# Altium schematic sheet RF.SchDoc: RF
size A4
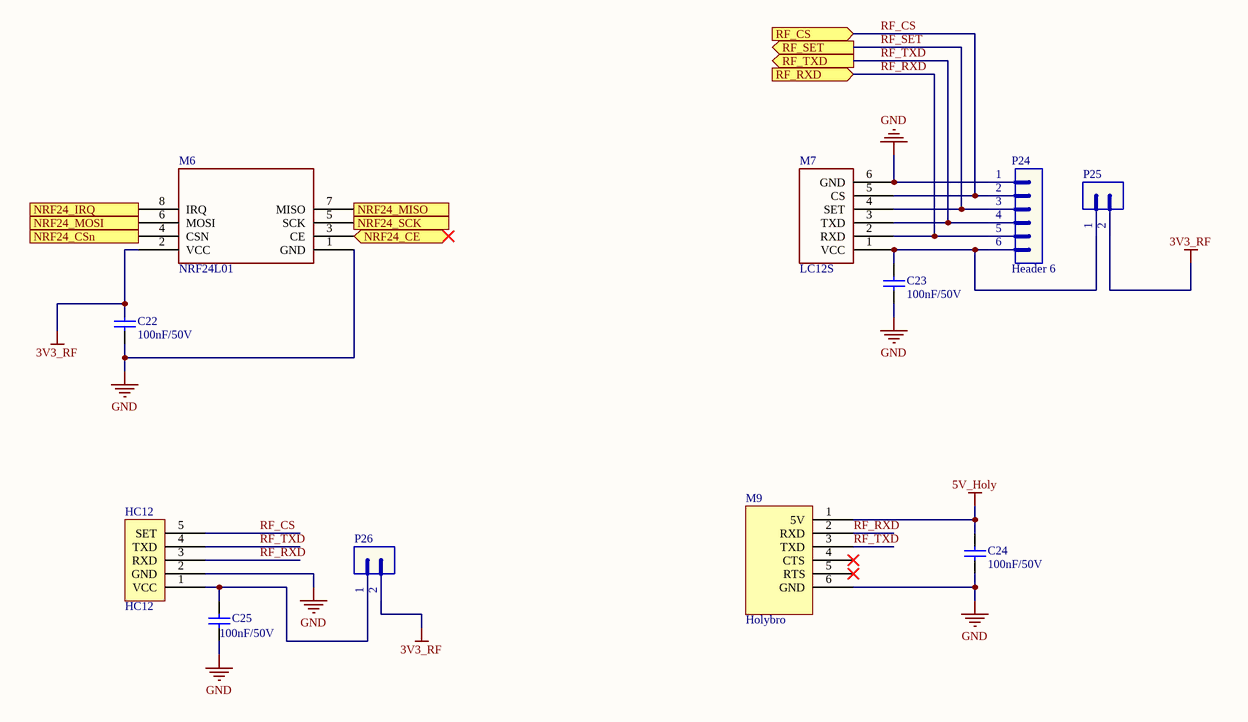
[diagram p0: RF.SchDoc]

## Parts
C22  value 100nF/50V  [CAP-SM-0805]  (hidden comment: Cap-100nF-50V-0805)
C23  value 100nF/50V  [CAP-SM-0805]  (hidden comment: Cap-100nF-50V-0805)
C24  value 100nF/50V  [CAP-SM-0805]  (hidden comment: Cap-100nF-50V-0805)
C25  value 100nF/50V  [CAP-SM-0805]  (hidden comment: Cap-100nF-50V-0805)
HC12  HC12  [HC12]
M6  NRF24L01  [NRF24L01]
M7  LC12S  [LC12S]
M9  Holybro  [Holybro]
P24  Header 6  [JP6]
P25  Header 2  [JP2]  (value not drawn)
P26  Header 2  [JP2]  (value not drawn)

## Ports
NRF24_CE (bidir), NRF24_CSn (in), NRF24_IRQ (out), NRF24_MISO (out), NRF24_MOSI (in), NRF24_SCK (in), RF_CS (in), RF_RXD (in), RF_SET (out), RF_TXD (out)

## Nets
3V3_RF: C22.2 M6.2(VCC) P25.2 P26.2
5V_Holy: C24.2 M9.1(5V)
GND: C22.1 C23.1 C24.1 C25.1 HC12.2(GND) M6.1(GND) M7.6(GND) M9.6(GND) P24.1
NRF24_CE: M6.3(CE) ; port NRF24_CE
NRF24_CSn: M6.4(CSN) ; port NRF24_CSn
NRF24_IRQ: M6.8(IRQ) ; port NRF24_IRQ
NRF24_MISO: M6.7(MISO) ; port NRF24_MISO
NRF24_MOSI: M6.6(MOSI) ; port NRF24_MOSI
NRF24_SCK: M6.5(SCK) ; port NRF24_SCK
RF_CS: HC12.5(SET) M7.5(CS) P24.2 ; port RF_CS
RF_RXD: HC12.3(RXD) M7.2(RXD) M9.2(RXD) P24.5 ; port RF_RXD
RF_SET: M7.4(SET) P24.3 ; port RF_SET
RF_TXD: HC12.4(TXD) M7.3(TXD) M9.3(TXD) P24.4 ; port RF_TXD
NetC23_2: C23.2 M7.1(VCC) P24.6 P25.1
NetC25_2: C25.2 HC12.1(VCC) P26.1

Not connected (* = marked no-connect by the designer): M9 4(CTS)* 5(RTS)*

## Notes on the sheet
- Title
- Size:
- Date:
- A4
- Number:
- Time:
- Revision:
- Sheet
- of
- File:

## Library data of the parts
C22-C25 = Cap-100nF-50V-0805: CAP CER 0.1UF 50V Y5V 0805; Manufacturer: Samsung Electro-Mechanics; Manufacturer Part Number: CL21F104ZBCNNNC; Local Supplier: thegioiic; Local Supplier Link: https://thegioiic.com/products/tu-100nf-0-1uf-50v-0805; Supplier 1: Digikey; Supplier 1 Part Number: 1276-1007-1-ND; Supplier 1 Link: https://www.digikey.com/product-detail/en/samsung-electro-mechanics/CL21F104ZBCNNNC/1276-1007-1-ND/3889093
P24 = Header 6: Header, 6-Pin; LatestRevisionDate: 17-Jul-2002; LatestRevisionNote: Re-released for DXP Platform.; Publisher: Altium Limited
P25 P26 = Header 2: Header, 2-Pin; LatestRevisionDate: 17-Jul-2002; LatestRevisionNote: Re-released for DXP Platform.; Publisher: Altium Limited
HC12 = HC12: Local Supplier: Hshop; Local Supplier Link: https://hshop.vn/products/mach-thu-phat-rf-uart-si4463-433mhzkhoang-coch-1km; Local Supplier number Part: HS000897; Manufacturer: *; Manufacturer Part Number: *